# EAGLE design interior_panel (EAGLE 7.0.0)
CNAME: INTERIOR PANEL SCHEMATIC; CREVISION: 1.0; DESIGNER: nerdvellous
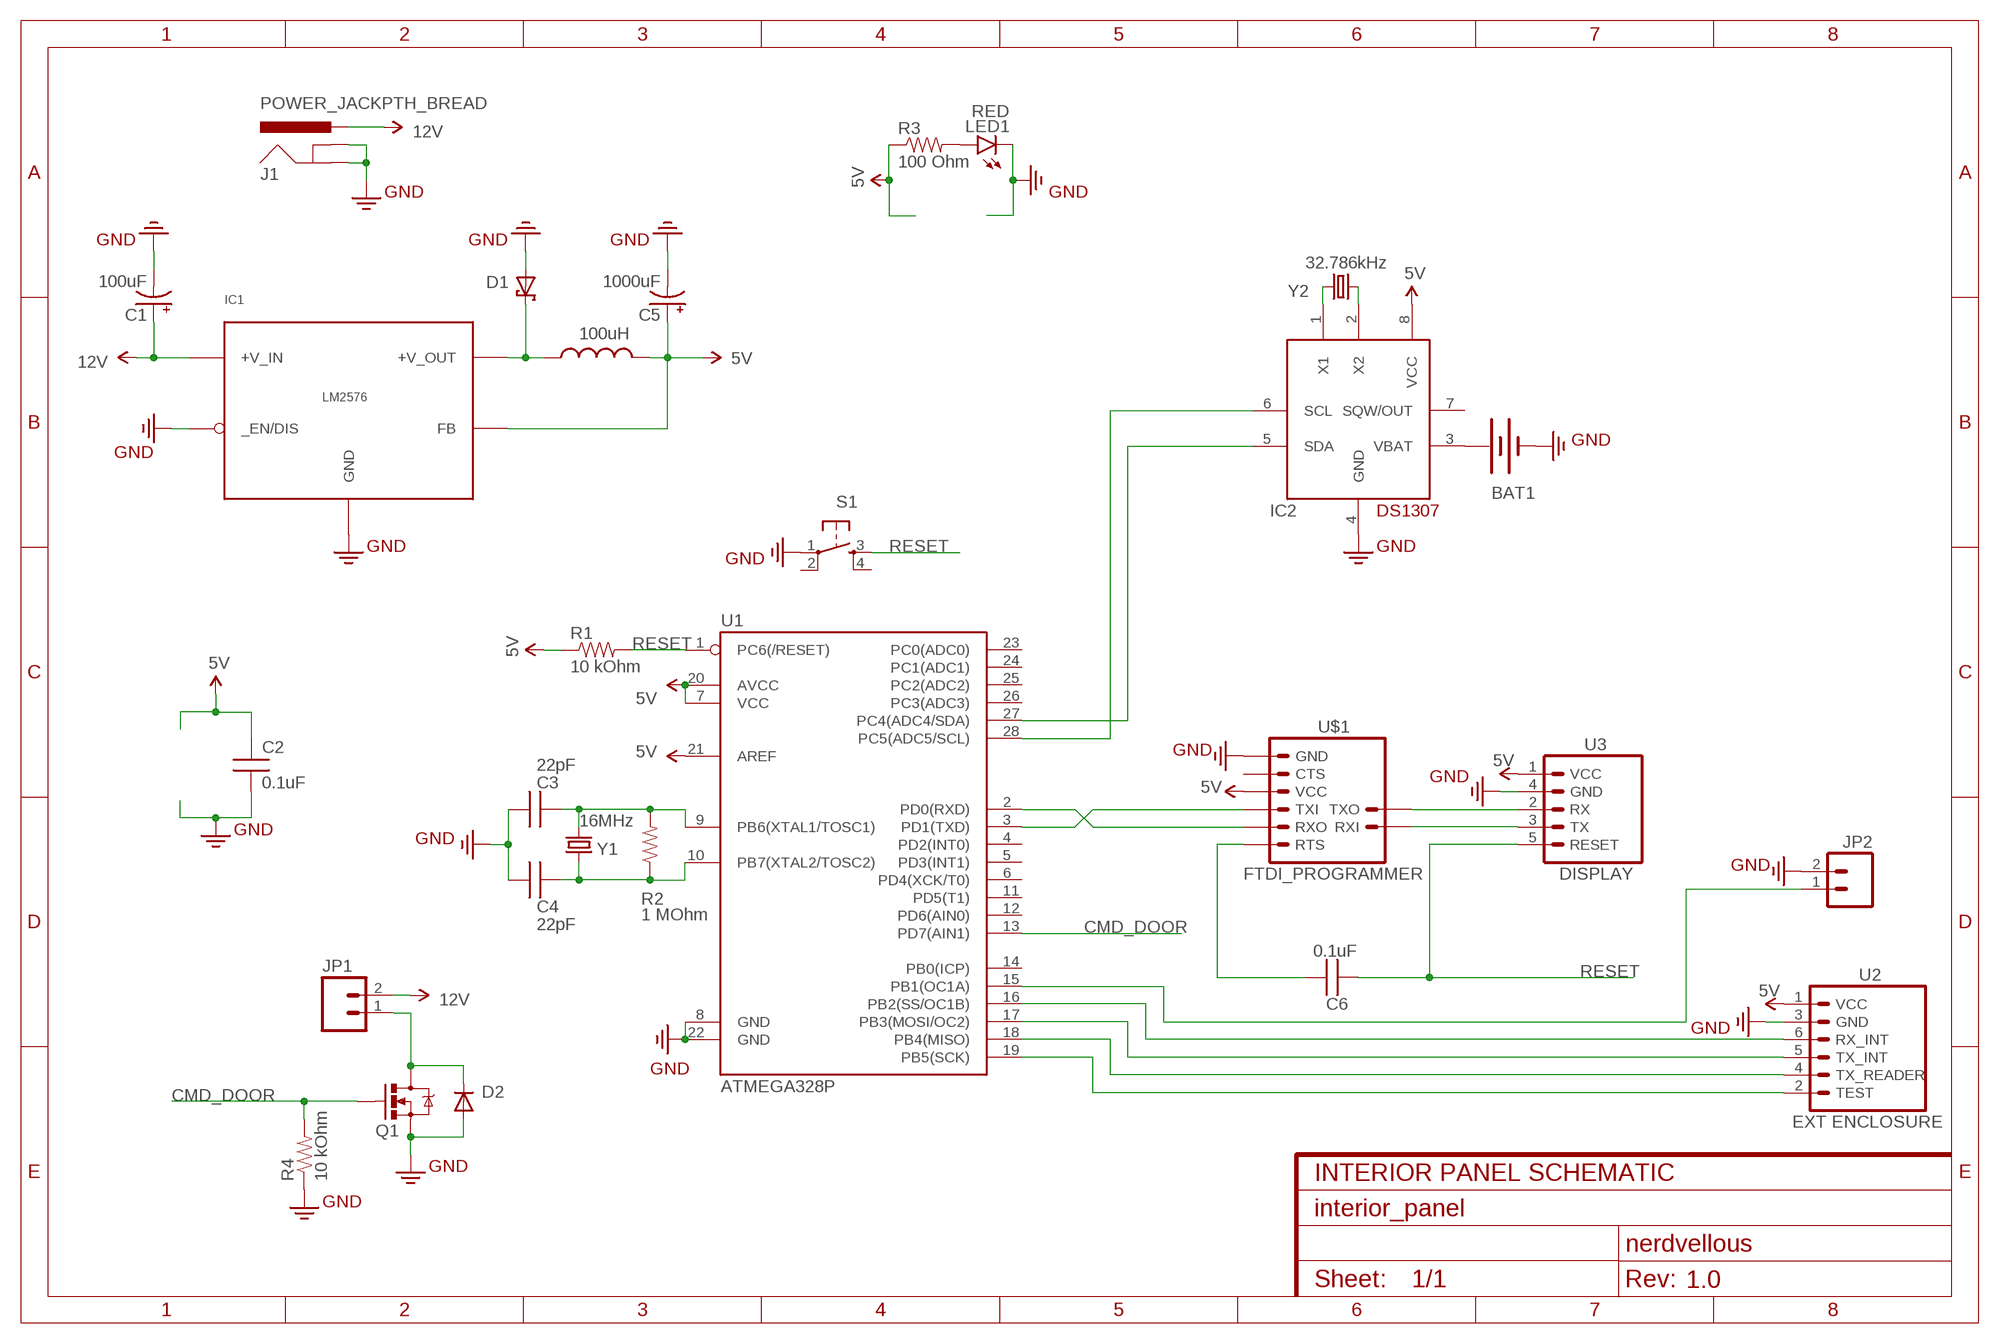
[diagram p0: schematic, sheet 1]

## Parts
BAT1  BATTERY12MMFULLPTH  [BATTCON_12MM_FULLPTH]
C1  100uF  CAP-100UF  [CPOL-RADIAL-100UF-25V]
C2  0.1uF  CAP-0.1UF  [CAP-PTH-SMALL]
C3  22pF  CAP-22PF  [CAP-PTH-SMALL]
C4  22pF  CAP-22PF  [CAP-PTH-SMALL]
C5  1000uF  CAP-1000UF16V  [CPOL-RADIAL-100UF-25V]
C6  0.1uF  CAP-0.1UF  [CAP-PTH-SMALL]
D1  1N5822  [DO-201AD]
D2  1N4004  [DO-41]
IC1  LM2576  [TO-220-5PIN]
IC2  DS1307  [DIL08]
J1  POWER_JACKPTH_BREAD  [POWER_JACK_PTH_BREAD]
JP1  M02PTH  [1X02]
JP2  M02PTH  [1X02]
L1  100uH  INDUCTORRLB0912  [RLB0912]
LED1  RED  LED5MM  [LED5MM]
Q1  MOSFET-NCHANNELFQP30N06L  [TO220V]
R1  10 kOhm  RES-10KOHM  [AXIAL-0.3]
R2  1 MOhm  RES-1MOHM  [AXIAL-0.3]
R3  100 Ohm  RES-100OHM  [AXIAL-0.3]
R4  10 kOhm  RES-10KOHM  [AXIAL-0.3]
S1  TAC_SWITCHPTH  [TACTILE-PTH]
U1  ATMEGA328P  [DIL28]
U2  EXT ENCLOSURE  CONNECTOR_INT_EXT  [1X06_POL]
U3  DISPLAY  CONNECTOR_DISPLAYPOL  [1X05_POL]
U$1  FTDI_PROGRAMMER  [FTDI_CABLE_JUMPER]
Y1  16MHz  CRYSTALHC49US  [HC49US]
Y2  32.786kHz  CRYSTALTC26V  [TC26V]

## Nets
5V [power5V]: C2.1 C5.1(+) IC1.P$4(FB) IC2.8(VCC) L1.2 R1.P$1 R3.P$1 U1.7(VCC) U1.20(AVCC) U1.21(AREF) U2.1(VCC) U3.1(VCC) U$1.VCC
12V: C1.1(+) IC1.P$1(+V_IN) J1.PWR JP1.2
CMD_DOOR: Q1.1(G) R4.P$2 U1.13(PD7(AIN1))
GND: BAT1.- C1.2(-) C2.2 C3.2 C4.2 C5.2(-) D1.A D2.A IC1.P$3(GND) IC1.P$5(_EN/DIS) IC2.4(GND) J1.GND J1.GNDBREAK JP2.2 LED1.K(C) Q1.3(S) R4.P$1 S1.1 U1.8(GND) U1.22(GND) U2.3(GND) U3.4(GND) U$1.GND
N$1: D1.C IC1.P$2(+V_OUT) L1.1
N$2: U1.2(PD0(RXD)) U$1.TXFTDI(RXO)
N$3: D2.C JP1.1 Q1.2(D)
N$4: U1.3(PD1(TXD)) U$1.RXFTDI(TXI)
N$5: U3.3(TX) U$1.RXIC(RXI)
N$6: U3.2(RX) U$1.TXIC(TXO)
N$7: C3.1 R2.P$2 U1.9(PB6(XTAL1/TOSC1)) Y1.2
N$8: LED1.A R3.P$2
N$9: C4.1 R2.P$1 U1.10(PB7(XTAL2/TOSC2)) Y1.1
N$10: C6.2 U$1.RTS
N$11: IC2.1(X1) Y2.1
N$12: IC2.2(X2) Y2.2
N$13: BAT1.+1(+) BAT1.+2(+) IC2.3(VBAT)
N$14: IC2.6(SCL) U1.28(PC5(ADC5/SCL))
N$15: IC2.5(SDA) U1.27(PC4(ADC4/SDA))
N$16: U1.18(PB4(MISO)) U2.4(TX_READER)
N$17: U1.16(PB2(SS/OC1B)) U2.6(RX_INT)
N$18: U1.17(PB3(MOSI/OC2)) U2.5(TX_INT)
N$19: U1.19(PB5(SCK)) U2.2(TEST)
N$20: JP2.1 U1.15(PB1(OC1A))
RESET: C6.1 R1.P$2 S1.3 U1.1(PC6(/RESET)) U3.5(RESET)
Unconnected: IC2.7(SQW/OUT) S1.2 S1.4 U1.4(PD2(INT0)) U1.5(PD3(INT1)) U1.6(PD4(XCK/T0)) U1.11(PD5(T1)) U1.12(PD6(AIN0)) U1.14(PB0(ICP)) U1.23(PC0(ADC0)) U1.24(PC1(ADC1)) U1.25(PC2(ADC2)) U1.26(PC3(ADC3)) U$1.CTS

## Library data of the parts
BAT1 = nerdvellous-electromechanical:BATTERY: Battery Holders Various common sizes : AA, AAA, 20mm coin cell and 12mm coin cell. 20MM_4LEGS, BATT-10373
C1 = nerdvellous-capacitors:CAP-100UF: 100uF capacitor
C2 C6 = nerdvellous-capacitors:CAP-0.1UF: 0.1uF capacitor; PROD_ID_SF: CAP-08370
C3 C4 = nerdvellous-capacitors:CAP-22PF: 0.1uF capacitor; PROD_ID_SF: CAP-08370
C5 = nerdvellous-capacitors:CAP-1000UF: 1000uF capacitor
D1 = nerdvellous-passive:1N5822: SCHOTTKY BARRIER RECTIFIER 3A
D2 = nerdvellous-passive:1N4004: GENERAL PURPOSE RECTIFIER 1A
IC1 = nerdvellous-power:LM2576: LM2576/LM2576HV Series SIMPLE SWITCHER® 3A Step-Down Voltage Regulator IN-LINE PACKAGE
IC2 = nerdvellous-digital:DS1307: DS1307 Real time clock (RTC) with battery backup ability. Talk to it via i2c
J1 = nerdvellous-electromechanical:POWER_JACK: Power Jack This is the standard 5.5mm barrel jack for power. The PTH is the most common, proven, reliable, footprint. The Slot footprint only works if the mill layer is transmitted to the PCB fab house so be warned. Mating wall wart : TOL-00298 (and others); PROD_ID: PRT-10811
JP1 JP2 = nerdvellous-connectors:M02: Standard 2-pin 0.1" header. Use with - straight break away headers ( PRT-00116) - right angle break away headers (PRT-00553) - swiss pins (PRT-00743) - machine pins (PRT-00117) - female headers (PRT-00115) Molex polarized connector foot print use with: PRT-08233 with associated crimp pins and housings. 2.54_SCREWTERM for use with PRT-10571. 3.5mm Screw Terminal footprints for PRT-08084 5mm Screw Terminal footprints for use with PRT-08433
L1 = nerdvellous-passive:INDUCTOR: Inductors Basic Inductor/Choke - 0603 and 1206. Footprints are not proven and vary greatly between part numbers. SRN6045- 33uH, 20% 1.4A SDR0403-560KL - 56uH, 10%, 500mA RMS/740mA peak
LED1 = nerdvellous-led:LED: LEDs Standard schematic elements and footprints for 5mm, 3mm, 1206, and 0603 sized LEDs. 5mm - Spark Fun Electronics SKU : COM-00529 (and others)
Q1 = nerdvellous-transistors:MOSFET-NCHANNEL: Common NMOSFET Parts MFG P/N Store ID Prod ID FDD8780 TRANS-09984 SI7820DN TRANS-11055 FDS6630A IC-08089 2N7002PW TRANS-11151 FQP30N06L COM-10213 TRANS-10060 BSS123LT1G TRANS-08345 BSS138 TRANS-00830 BS170 2N7000; PROD_ID: TRANS-10060
R1 R4 = nerdvellous-resistors:RES-10KOHM: 10 kOhm resistor
R2 = nerdvellous-resistors:RES-1MOHM: 1 MOhm resistor
R3 = nerdvellous-resistors:RES-100OHM: 100 Ohm resistor
S1 = nerdvellous-electromechanical:TAC_SWITCH: Momentary Switch Button commonly used for reset or general input. Spark Fun Electronics SKU : COM-00097 SMT- SWCH-08247
U1 = nerdvellous-digital:ATMEGA328P: uC used in the Arduino 32kb flash, 1k EEPROM, 2k SRAM This is the through-hole version of this chip.
U2 = nerdvellous-house-manager:CONNECTOR_INT_EXT
U3 = nerdvellous-house-manager:CONNECTOR_DISPLAY
U$1 = nerdvellous-connectors:FTDI_PROGRAMMER
Y1 Y2 = nerdvellous-electromechanical:CRYSTAL: Various standard crystals. Proven footprints. Spark Fun Electronics SKU : COM-00534

## Net classes
1 power5V: width 0.813 mm

## Board
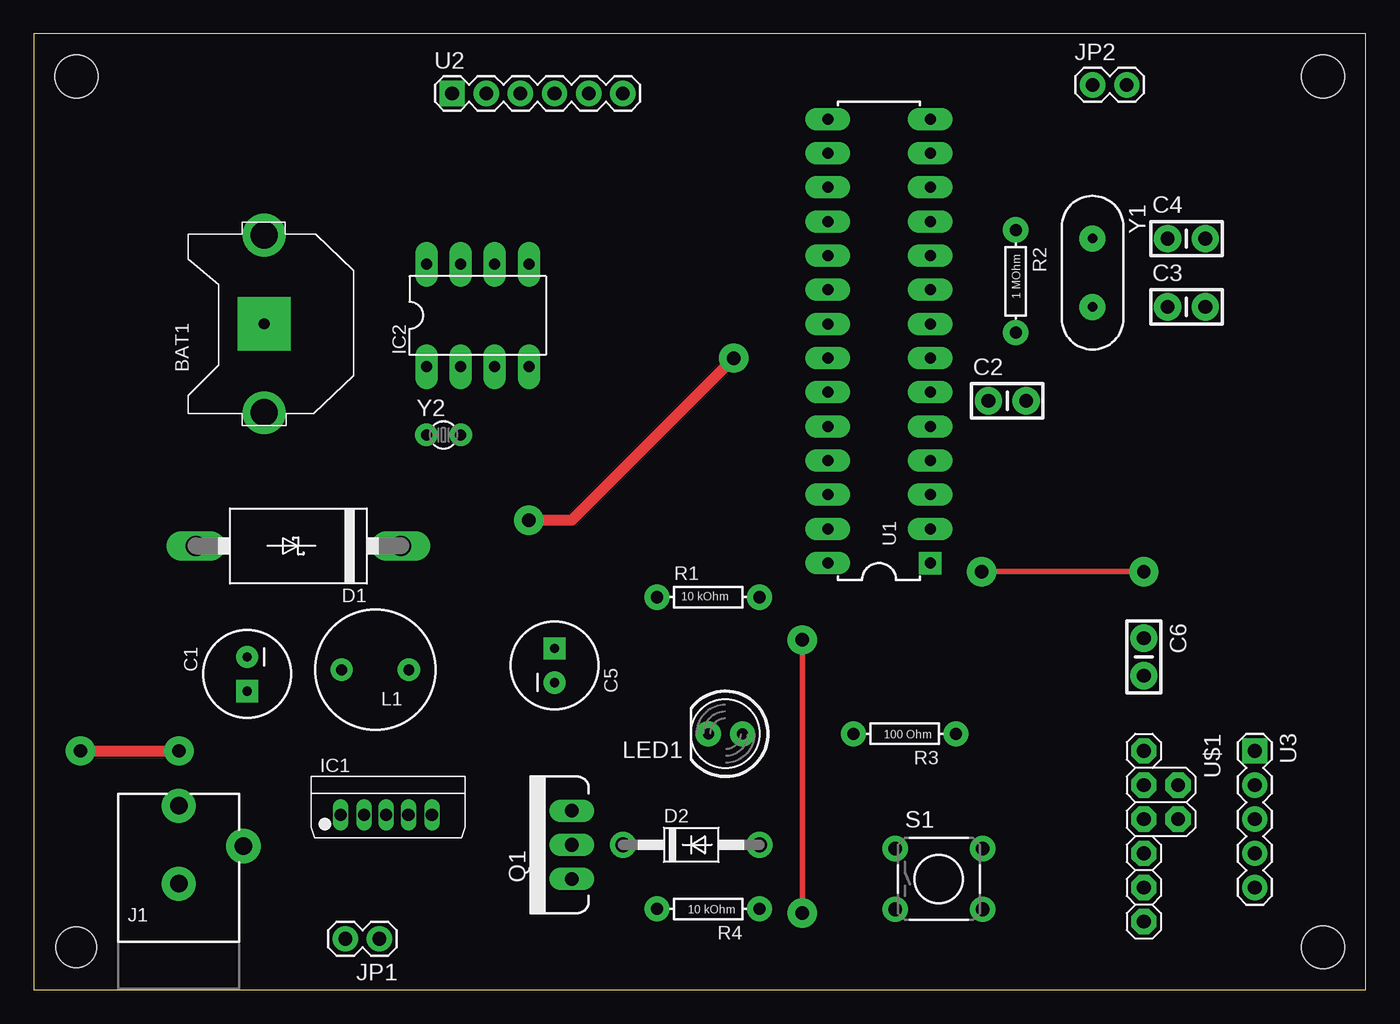
[diagram p1: board, top side]
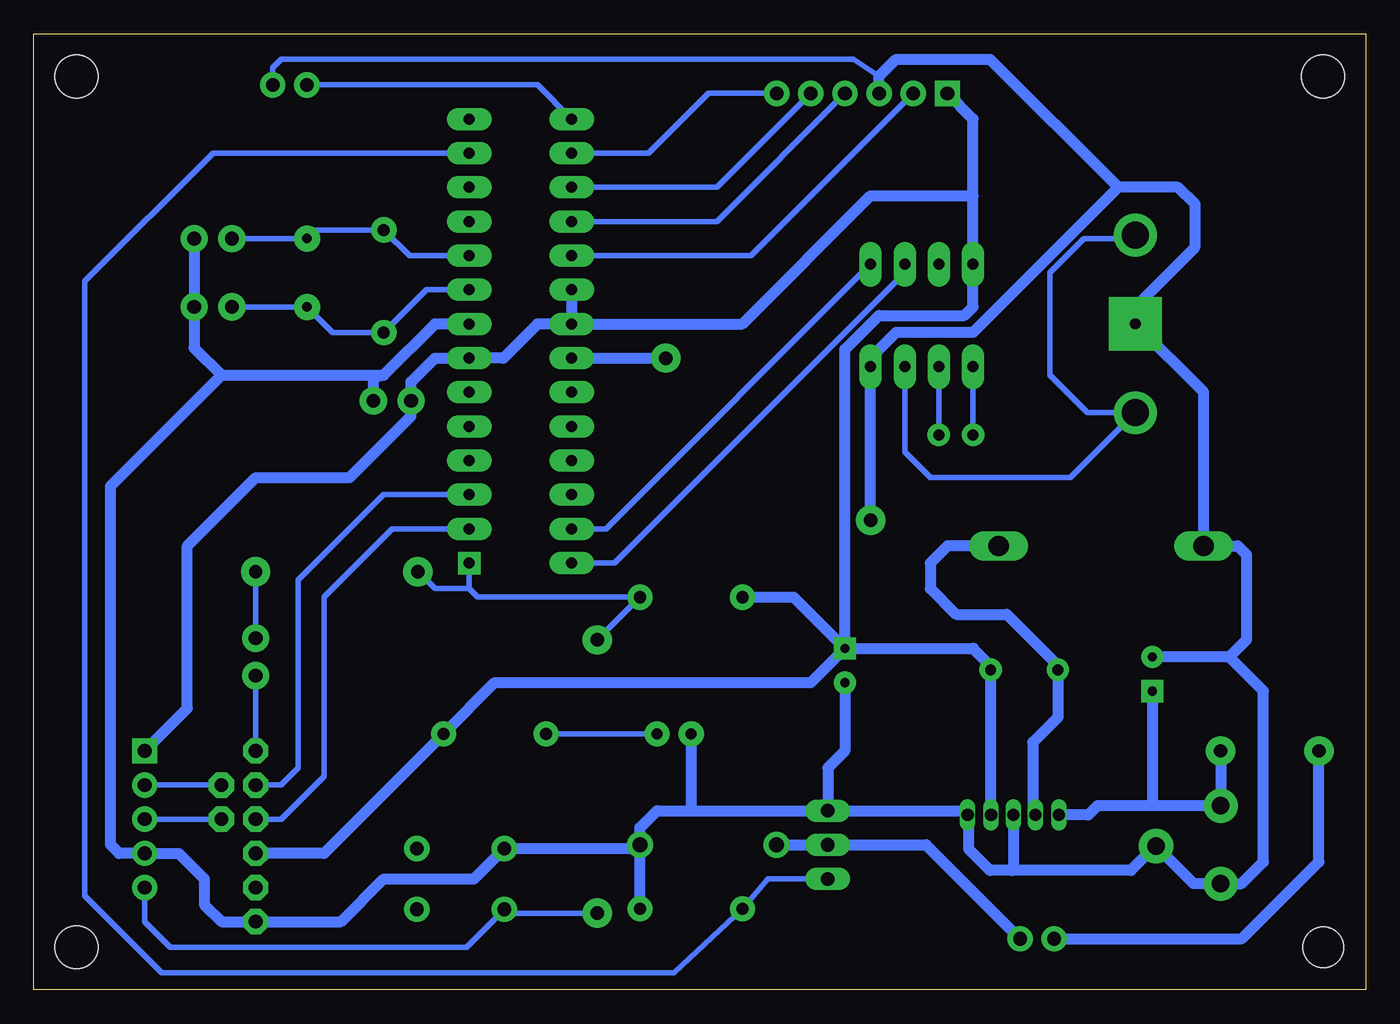
[diagram p2: board, bottom side, seen from below]

Size 99.06 x 71.12 mm. Coordinates in mm from the lower left corner, seen from the top.
Outline: 0,0 99.06,0 99.06,71.12 0,71.12 0,0
Copper layers (1*16): Top 0.035mm / dielectric 1.5mm / Bottom 0.035mm
Design rules "default *": minimum track width 10mil, minimum drill 24mil, track to track 8mil, track to pad 8mil, pad to pad 8mil, via to via 8mil, smd to smd 8mil, copper to edge 40mil, drill to drill 8mil, minimum pad ring 0mil, minimum via ring 8mil, stop-mask expansion 4mil, vias tented up to drill 0mil, thermal gap 10mil
Holes 3 mm at 3.17,3.17
Holes 3.2 mm at 3.17,67.94 95.89,3.17 95.89,67.94

### Footprints (pad centres in the part's own frame; a part is rotated, then mirrored left to right if it is on the bottom)
BATTCON_12MM_FULLPTH = drill 2 pad 3.175: +1 -6.604,0; +2 6.604,0 | drill 0.8 pad 3.962 square: - 0,0
CPOL-RADIAL-100UF-25V = drill 0.7 pad 1.651 square: 1 1.27,0 | drill 0.7 pad 1.651: 2 -1.27,0
CAP-PTH-SMALL = drill 1.016 pad 2.032: 1 -1.397,0; 2 1.397,0
DO-201AD = drill 1.499 pad 2.184 long: A 7.62,0; C -7.62,0
DO-41 = drill 1.118 pad 1.93: A 5.08,0; C -5.08,0
TO-220-5PIN = drill 0.9 pad 1.016 long: P$1 -2.896,0; P$2 -1.148,0; P$3 0.5,0; P$4 2.148,0; P$5 3.896,0
DIL08 = drill 0.813 pad 1.676 long: 1 -3.81,-3.81; 2 -1.27,-3.81; 3 1.27,-3.81; 4 3.81,-3.81; 5 3.81,3.81; 6 1.27,3.81; 7 -1.27,3.81; 8 -3.81,3.81
POWER_JACK_PTH_BREAD = drill 1.3 pad 2.54: GND 0,7.9; GNDBREAK 4.8,10.7; PWR 0,13.7
1X02 = drill 1.016 pad 1.88: 1 0,0; 2 2.54,0
RLB0912 = drill 0.813 pad 1.651: 1 2.502,0; 2 -2.502,0
LED5MM = drill 0.813 pad 1.88: A -1.27,0; K 1.27,0
TO220V = drill 1.016 pad 1.676 long: 1 -2.54,0; 2 0,0; 3 2.54,0
AXIAL-0.3 = drill 0.9 pad 1.88: P$1 -3.81,0; P$2 3.81,0
TACTILE-PTH = drill 1.016 pad 1.88: 1 -3.251,2.261; 2 3.251,2.261; 3 -3.251,-2.261; 4 3.251,-2.261
DIL28 = drill 0.813 pad 1.676 square: 1 -16.51,-3.81 | drill 0.813 pad 1.676 long: 2 -13.97,-3.81; 3 -11.43,-3.81; 4 -8.89,-3.81; 5 -6.35,-3.81; 6 -3.81,-3.81; 7 -1.27,-3.81; 8 1.27,-3.81; 9 3.81,-3.81; 10 6.35,-3.81; 11 8.89,-3.81; 12 11.43,-3.81; 13 13.97,-3.81; 14 16.51,-3.81; 15 16.51,3.81; 16 13.97,3.81; 17 11.43,3.81; 18 8.89,3.81; 19 6.35,3.81; 20 3.81,3.81; 21 1.27,3.81; 22 -1.27,3.81; 23 -3.81,3.81; 24 -6.35,3.81; 25 -8.89,3.81; 26 -11.43,3.81; 27 -13.97,3.81; 28 -16.51,3.81
1X06_POL = drill 1.016 pad 1.88 square: 1 0,0 | drill 1.016 pad 1.88: 2 2.54,0; 3 5.08,0; 4 7.62,0; 5 10.16,0; 6 12.7,0
1X05_POL = drill 1.016 pad 1.88 square: 1 0,0 | drill 1.016 pad 1.88: 2 2.54,0; 3 5.08,0; 4 7.62,0; 5 10.16,0
FTDI_CABLE_JUMPER = drill 1.016 pad 1.88 octagon: CTS 10.16,0; GND 12.7,0; RTS 0,0; RXFTDI 2.54,0; RXIC 5.08,2.54; TXFTDI 5.08,0; TXIC 2.54,2.54; VCC 7.62,0
HC49US = drill 0.7 pad 1.93: 1 -2.54,0; 2 2.54,0
TC26V = drill 0.813 pad 1.676: 1 -1.27,0; 2 1.27,0

### Placement (x,y rotation side)
BAT1  17.14,49.53 90 top
C1  15.88,23.5 270 top
C2  72.39,43.81 0 top
C3  85.72,50.8 0 top
C4  85.72,55.88 0 top
C5  38.73,24.13 90 top
C6  82.55,24.77 270 top
D1  19.68,33.02 180 top
D2  48.9,10.79 0 top
IC1  25.72,13.02 0 top
IC2  33.02,50.16 0 top
J1  10.79,0 0 top
JP1  25.72,3.81 180 top
JP2  78.74,67.31 0 top
L1  25.4,23.81 180 top
LED1  51.44,19.05 180 top
Q1  40.01,10.79 90 top
R1  50.16,29.21 0 top
R2  73.03,52.7 270 top
R3  64.77,19.05 180 top
R4  50.16,6.03 180 top
S1  67.31,8.26 0 top
U1  62.87,48.26 90 top
U2  31.11,66.67 0 top
U3  90.81,17.78 270 top
U$1  82.55,17.78 270 top
Y1  78.74,53.34 270 top
Y2  30.48,41.27 0 top

### Tracks (layer width: path | path; a pad name or v marks a point on that pad's centre or on a via)
5V
  Bottom 0.813: C5.1 29.21,25.4 | 29.21,25.4 29.17,25.4 | U1.20 U1.21 | C5.1 38.73,47.62 36.2,50.16 29.84,50.16 29.21,50.8 IC2.8 29.21,59.05 | 29.21,59.05 29.21,64.77 U2.1 | U1.21 46.35,49.53 36.83,59.05 29.21,59.05 | U1.21 61.59,49.53 64.14,46.99 U1.7 69.22,46.99 70.99,45.21 C2.1 70.99,42.67 75.56,38.1 82.55,38.1 87.63,33.02 87.63,20.95 U3.1 | R1.P$1 42.55,29.21 C5.1 | U$1.VCC 77.47,10.16 R3.P$1 64.77,22.86 41.27,22.86 C5.1 | IC1.P$4 27.9,13.05 L1.2 27.9,24.09 29.21,25.4
12V  (via drill 1 pad 2.18)
  Top 0.813: v3.49,17.78 v10.79,17.78
  Bottom 0.813: 15.88,13.7 J1.PWR v10.79,17.78 | 15.88,13.7 19.95,13.7 20.64,13.02 IC1.P$1 | C1.1 15.88,13.7 | JP1.2 9.21,3.81 3.49,9.53 v3.49,17.78
CMD_DOOR
  Bottom 0.406: Q1.1 44.45,8.26 R4.P$2 51.44,1.27 89.53,1.27 95.25,6.99 95.25,52.7 85.72,62.23 U1.13
GND  (via drill 1 pad 2.18)
  Top 0.813: v52.07,46.99 40.01,34.92 v36.83,34.92
  Bottom 0.406: JP2.2 81.28,68.58 80.64,69.22 38.1,69.22 36.2,67.94
  Bottom 0.813: D2.A 53.98,12.06 52.7,13.34 50.16,13.34 | 50.16,13.34 Q1.3 | 10.16,24.77 8.89,26.04 8.89,32.38 9.53,33.02 D1.A 12.06,44.45 BAT1.- 17.14,50.8 12.7,55.24 12.7,58.42 13.97,59.69 18.41,59.69 | 10.16,24.77 C1.2 | R4.P$1 D2.A | 10.16,24.77 7.62,22.23 7.62,9.53 9.24,7.9 J1.GND 12.79,7.9 J1.GNDBREAK 15.65,10.7 17.46,8.89 26.35,8.89 | C4.2 C3.2 87.12,47.75 85.09,45.72 | 18.41,59.69 29.21,48.9 34.92,48.9 36.83,46.99 IC2.4 v36.83,34.92 | LED1.K 50.16,13.34 | U2.3 36.2,67.94 34.92,69.22 27.94,69.22 18.41,59.69 | U1.8 69.22,49.53 73.03,45.72 | 85.09,45.72 73.03,45.72 | 85.09,45.72 93.34,37.47 93.34,10.79 92.71,10.16 U3.4 88.27,10.16 86.36,8.26 86.36,6.35 85.09,5.08 U$1.GND 76.2,5.08 73.03,8.26 66.32,8.26 S1.1 54.25,10.52 D2.A | C2.2 73.79,45.59 73.03,45.72 | U1.22 v52.07,46.99 | 26.35,8.89 27.94,8.89 29.53,10.48 29.53,12.93 IC1.P$5 29.93,13.34 Q1.3 | IC1.P$3 26.22,9.03 26.35,8.89 | C5.2 38.73,17.78 40.01,16.51 Q1.3
N$1
  Bottom 0.813: D1.C 31.11,33.02 32.38,31.75 32.38,29.84 30.48,27.94 26.71,27.94 22.9,24.13 L1.1 22.9,20.28 24.77,18.41 24.77,13.21 IC1.P$2
N$2
  Bottom 0.406: U$1.TXFTDI 80.64,12.7 77.47,15.88 77.47,29.21 72.39,34.29 U1.2
N$3
  Bottom 0.813: D2.C Q1.2 32.7,10.79 JP1.1
N$4
  Bottom 0.406: U$1.RXFTDI 80.64,15.24 79.38,16.51 79.38,30.48 73.03,36.83 U1.3
N$5
  Bottom 0.406: U3.3 U$1.RXIC
N$6
  Bottom 0.406: U3.2 U$1.TXIC
N$7
  Bottom 0.406: C3.1 Y1.2 76.83,48.9 R2.P$2 69.85,52.07 U1.9
N$8
  Bottom 0.406: LED1.A R3.P$2
N$9
  Bottom 0.406: C4.1 Y1.1 78.11,56.52 R2.P$1 71.12,54.61 U1.10
N$10
  Bottom 0.406: U$1.RTS C6.2
N$11
  Bottom 0.406: Y2.1 IC2.1
N$12
  Bottom 0.406: Y2.2 IC2.2
N$13
  Bottom 0.406: BAT1.+2 18.16,55.88 20.95,55.88 23.5,53.34 23.5,45.72 20.7,42.93 BAT1.+1 21.97,38.1 32.38,38.1 34.29,40.01 IC2.3
N$14
  Bottom 0.406: U1.28 55.88,31.75 34.29,53.34 IC2.6
N$15
  Bottom 0.406: IC2.5 56.52,34.29 U1.27
N$16
  Bottom 0.406: U2.4 48.26,57.15 U1.18
N$17
  Bottom 0.406: U2.6 48.9,66.67 53.34,62.23 U1.16
N$18
  Bottom 0.406: U2.5 48.26,59.69 U1.17
N$19
  Bottom 0.406: U1.19 45.72,54.61 U2.2
N$20
  Bottom 0.406: JP2.1 61.59,67.31 U1.15
RESET  (via drill 1 pad 2.18)
  Top 0.406: v82.55,31.11 v70.48,31.11 | v57.15,5.71 v57.15,26.04
  Bottom 0.406: U3.5 90.81,5.08 88.9,3.17 66.88,3.17 S1.3 63.78,5.71 v57.15,5.71 | 66.67,29.84 66.04,29.21 R1.P$2 v57.15,26.04 | 66.67,29.84 U1.1 | C6.1 v82.55,31.11 | v70.48,31.11 69.22,29.84 66.67,29.84